# Altium schematic sheet Sheet1.SchDoc
size A2; Address1: Address1; Address2: Address2; Address3: Address3; Address4: Address4; DocumentNumber: АБВГ.123456.001 Э3; SheetNumber: 2; Scale: 1:1; DocumentType: Схема электрическая принципиальная; FirstReferrence: АБВГ.123456.001
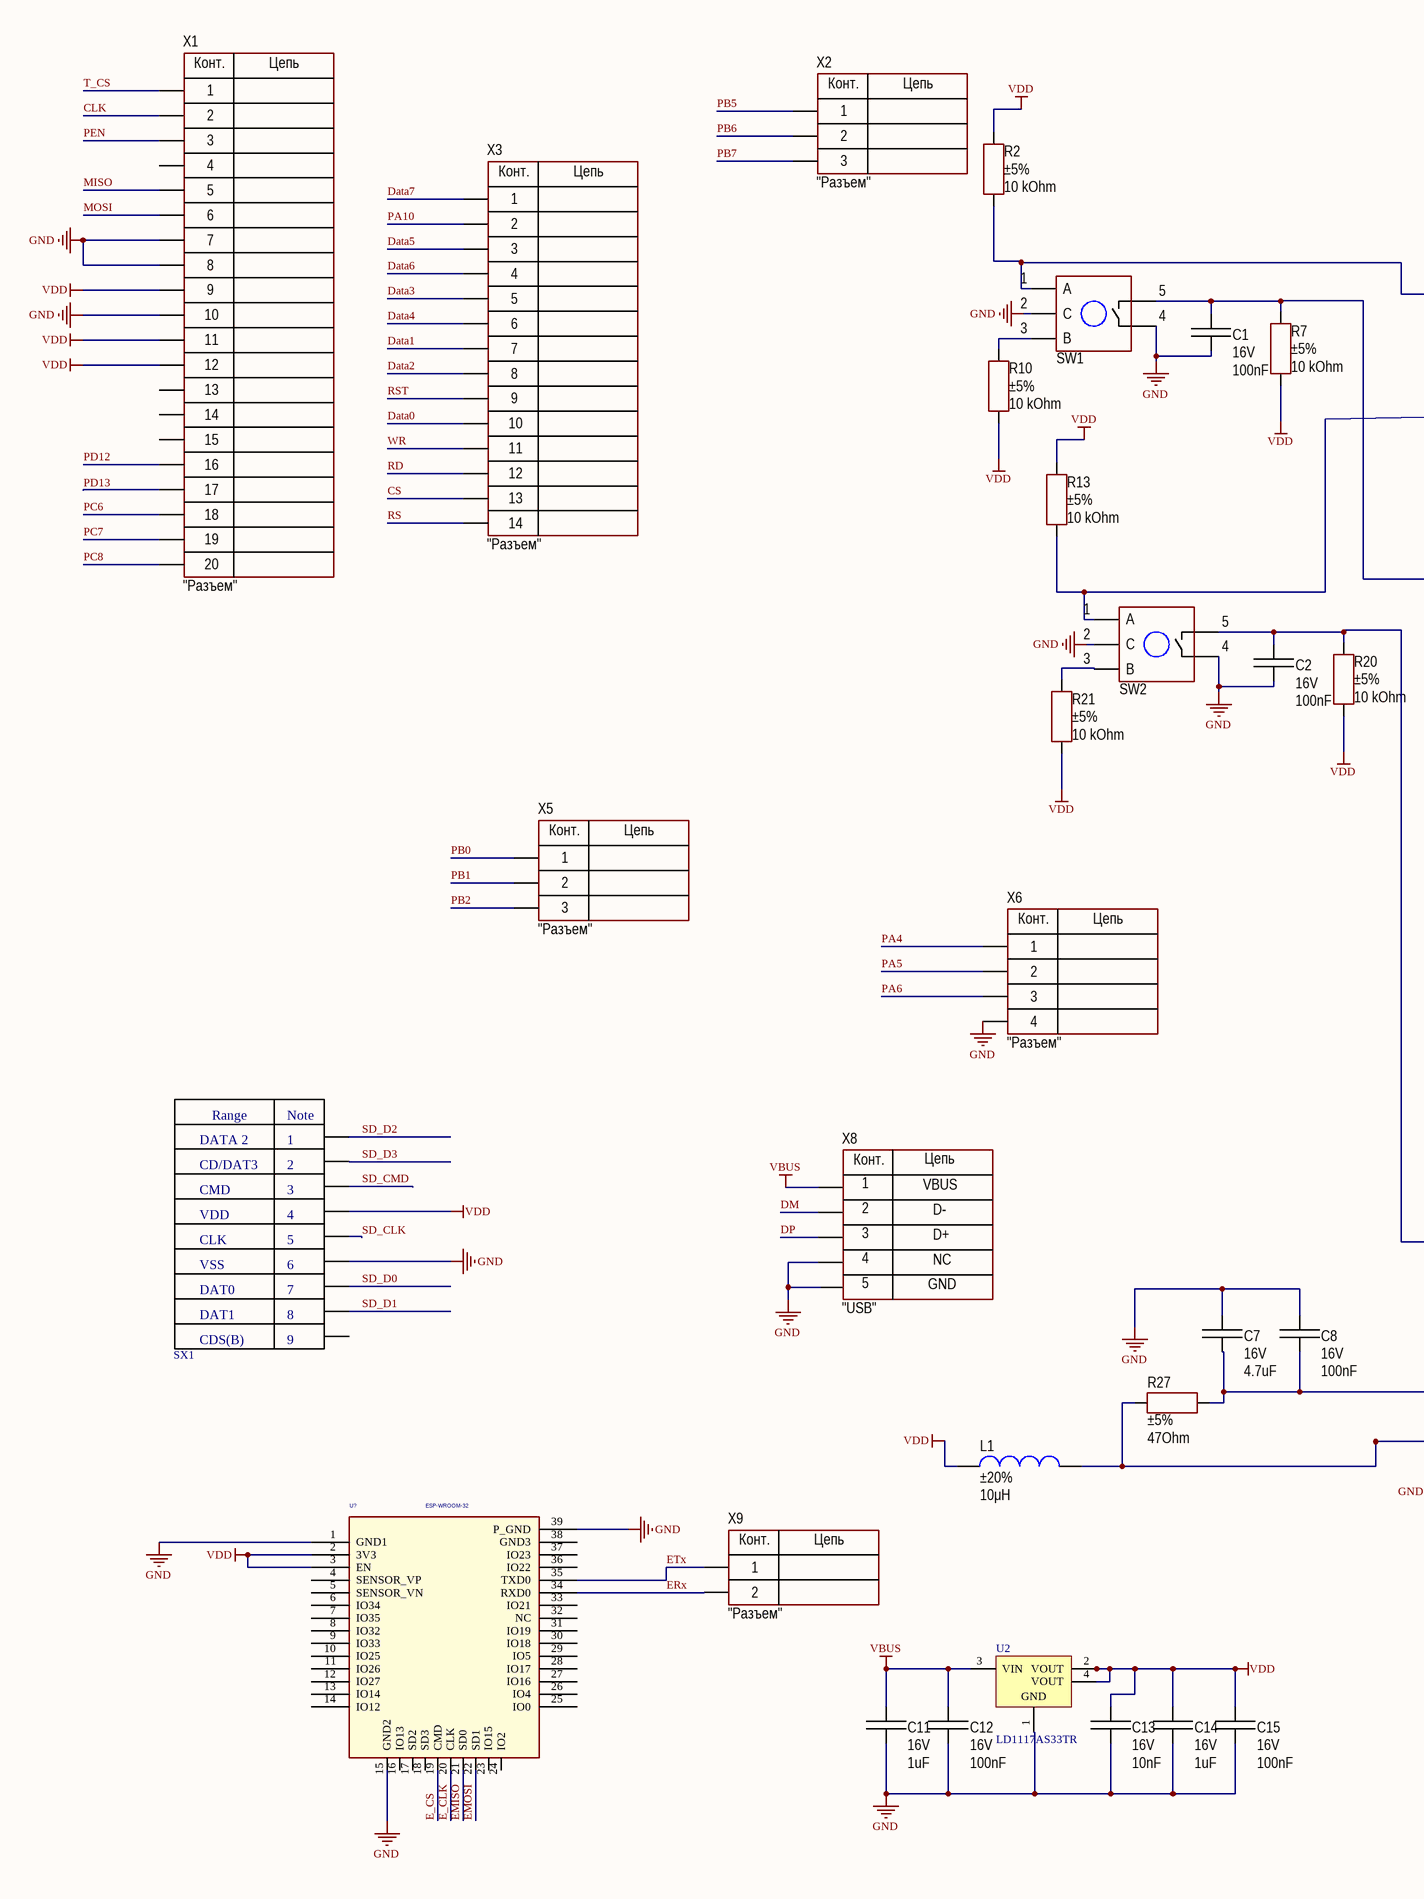
[diagram p0: Sheet1.SchDoc, left]
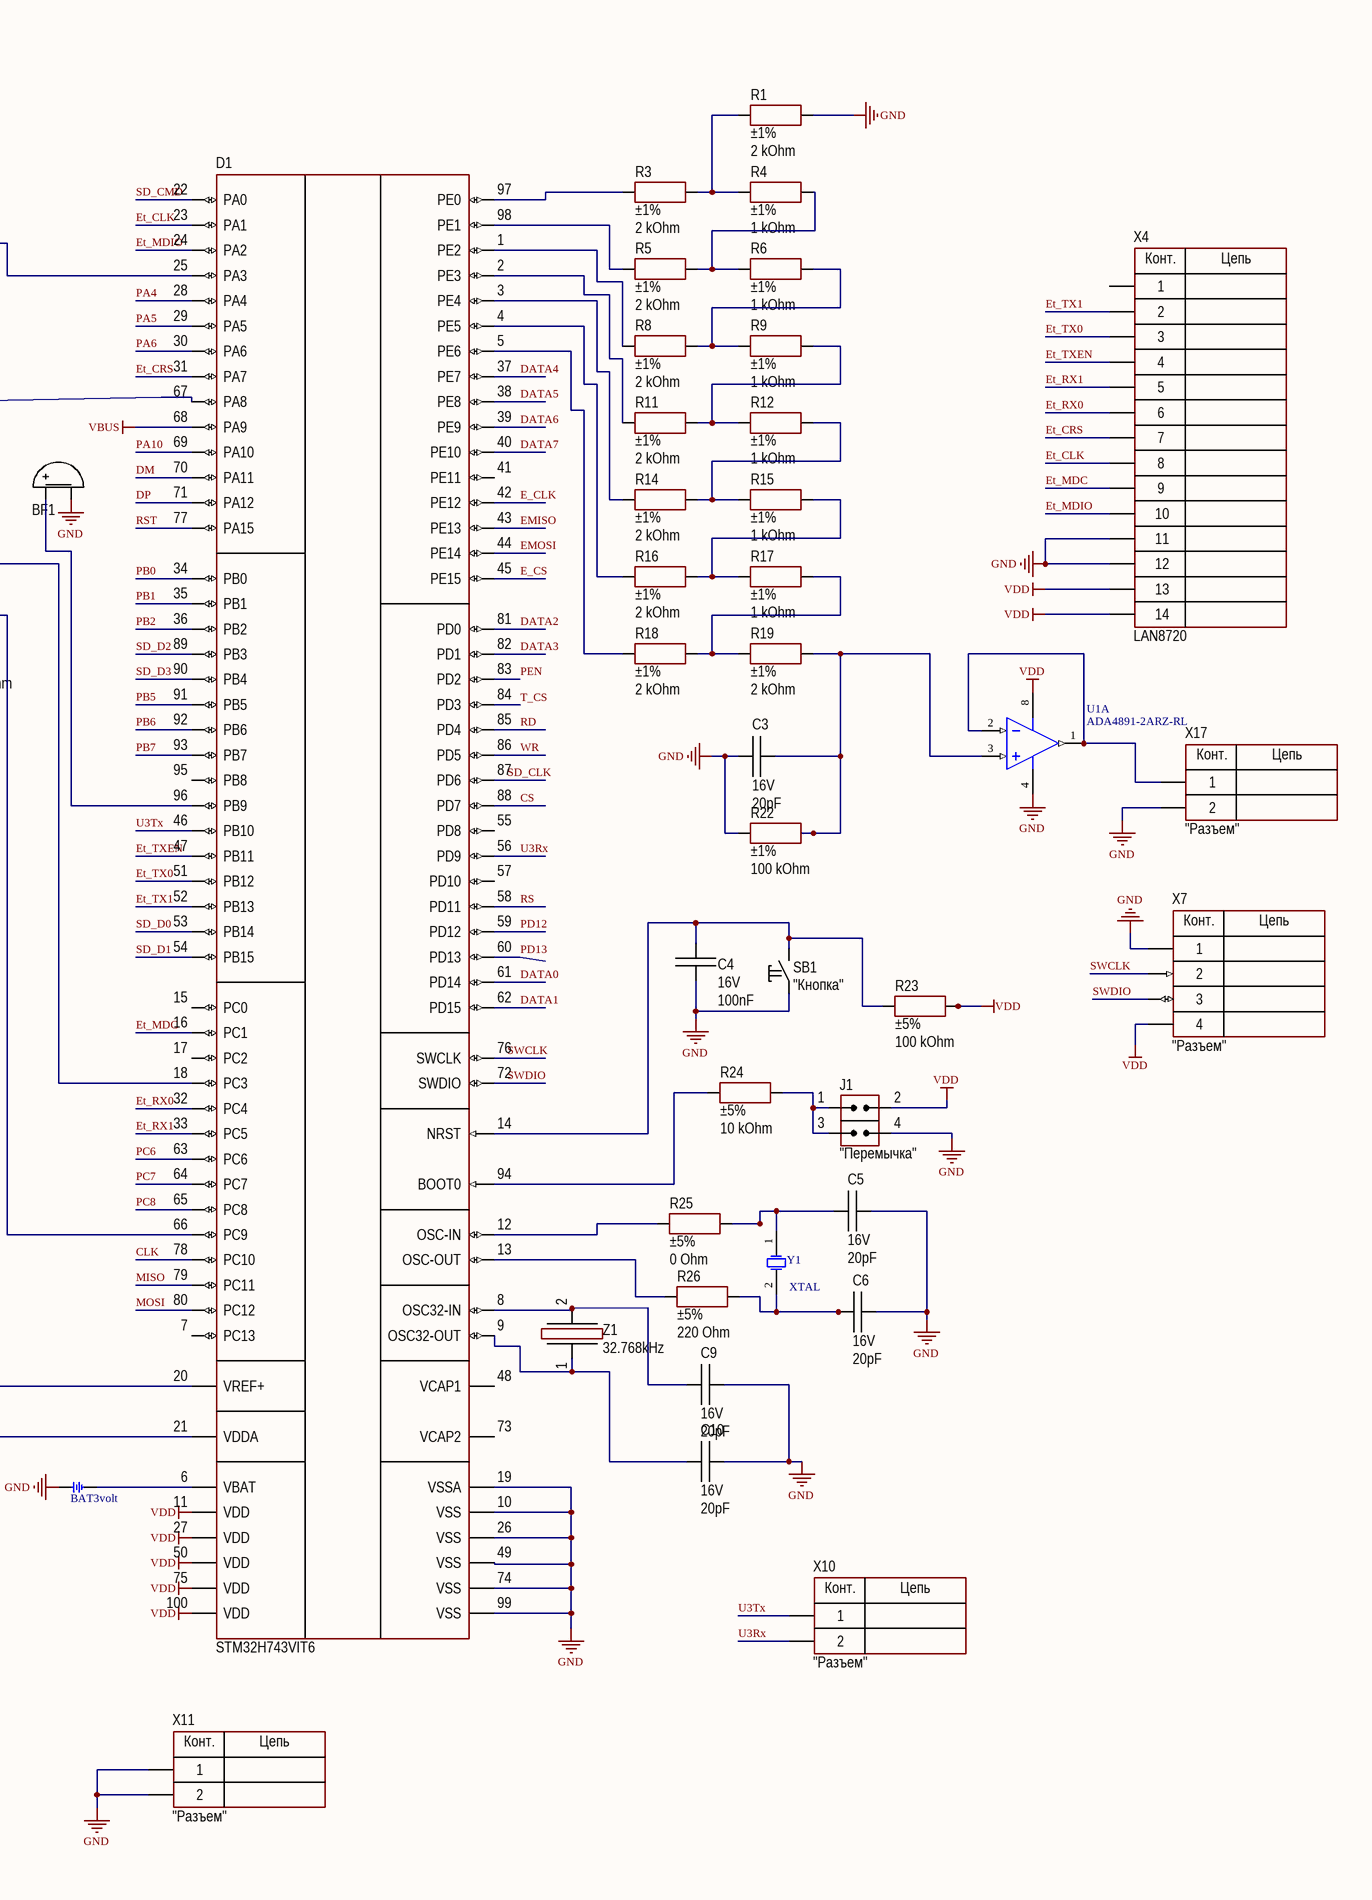
[diagram p1: Sheet1.SchDoc, right]

## Parts
BF1  (no value)  [BUZ: AT-0927-TT-6-R]
BT1  BAT3volt  [BTH2032]
C1  value 100nF  Voltage: 16V  [CAP: 0603]
C2  value 100nF  Voltage: 16V  [CAP: 0603]
C3  value 20pF  Voltage: 16V  [CAP: 0603]
C4  value 100nF  Voltage: 16V  [CAP: 0603]
C5  value 20pF  Voltage: 16V  [CAP: 0603]
C6  value 20pF  Voltage: 16V  [CAP: 0603]
C7  value 4.7uF  Voltage: 16V  [CAP: 0603]
C8  value 100nF  Voltage: 16V  [CAP: 0603]
C9  value 20pF  Voltage: 16V  [CAP: 0603]
C10  value 20pF  Voltage: 16V  [CAP: 0603]
C11  value 1uF  Voltage: 16V  [CAP: 0603]
C12  value 100nF  Voltage: 16V  [CAP: 0603]
C13  value 10nF  Voltage: 16V  [CAP: 0603]
C14  value 1uF  Voltage: 16V  [CAP: 0603]
C15  value 100nF  Voltage: 16V  [CAP: 0603]
D1  (no value)  [100-LQFP]
J1  CommentText: "Перемычка"  [CON: PLD-4]
L1  value 10μH  Tolerance: ±20%  [IND: 0603]
R1  value 2 kOhm  Tolerance: ±1%  [RES: 0603]
R2  value 10 kOhm  Tolerance: ±5%  [RES: 0603]
R3  value 2 kOhm  Tolerance: ±1%  [RES: 0603]
R4  value 1 kOhm  Tolerance: ±1%  [RES: 0603]
R5  value 2 kOhm  Tolerance: ±1%  [RES: 0603]
R6  value 1 kOhm  Tolerance: ±1%  [RES: 0603]
R7  value 10 kOhm  Tolerance: ±5%  [RES: 0603]
R8  value 2 kOhm  Tolerance: ±1%  [RES: 0603]
R9  value 1 kOhm  Tolerance: ±1%  [RES: 0603]
R10  value 10 kOhm  Tolerance: ±5%  [RES: 0603]
R11  value 2 kOhm  Tolerance: ±1%  [RES: 0603]
R12  value 1 kOhm  Tolerance: ±1%  [RES: 0603]
R13  value 10 kOhm  Tolerance: ±5%  [RES: 0603]
R14  value 2 kOhm  Tolerance: ±1%  [RES: 0603]
R15  value 1 kOhm  Tolerance: ±1%  [RES: 0603]
R16  value 2 kOhm  Tolerance: ±1%  [RES: 0603]
R17  value 1 kOhm  Tolerance: ±1%  [RES: 0603]
R18  value 2 kOhm  Tolerance: ±1%  [RES: 0603]
R19  value 2 kOhm  Tolerance: ±1%  [RES: 0603]
R20  value 10 kOhm  Tolerance: ±5%  [RES: 0603]
R21  value 10 kOhm  Tolerance: ±5%  [RES: 0603]
R22  value 100 kOhm  Tolerance: ±1%  [RES: 0603]
R23  value 100 kOhm  Tolerance: ±5%  [RES: 0603]
R24  value 10 kOhm  Tolerance: ±5%  [RES: 0603]
R25  value 0 Ohm  Tolerance: ±5%  [RES: 0603]
R26  value 220 Ohm  Tolerance: ±5%  [RES: 0603]
R27  value 47Ohm  Tolerance: ±5%  [RES: 0603]
SB1  CommentText: "Кнопка"  [BUT: 6x6]
SW1  (no value)  [ENC: PEC-12]
SW2  (no value)  [ENC: PEC-12]
SX1  Microsd  [microsd]  (value not drawn)
U1  ADA4891-2ARZ-RL  [ADI-R-8_N]  (part A of 2)
U2  LD1117AS33TR  [SOT-223_N]
U?  ESP-WROOM-32  [Espressif ESP32-WROOM-32]
X1  CommentText: "Разъем"  [CON: PLD-20]
X2  CommentText: "Разъем"  [CON: PLS-3]
X3  CommentText: "Разъем"  [CON: PLD-14]
X4  CommentText: LAN8720  [CON: PLD-14]
X5  CommentText: "Разъем"  [CON: PLS-3]
X6  CommentText: "Разъем"  [CON: PLS-4]
X7  CommentText: "Разъем"  [CON: PLS-4]
X8  CommentText: "USB"  [CON: 0675031020]
X9  CommentText: "Разъем"  [CON: PLS-2]
X10  CommentText: "Разъем"  [CON: PLS-2]
X11  CommentText: "Разъем"  [CON: PLS-2]
X17  CommentText: "Разъем"  [CON: PLS-2]
Y1  XTAL  [R38]
Z1  Frequency: 32.768kHz  [OSC: 3215]

## Nets
GND: BF1.2(-) BT1.1 C1.2 C2.2 C3.1 C4.2 C5.2 C6.2 C7.2 C8.1 C9.2 C10.2 C11.1 C12.1 C13.1 C14.1 C15.1 D1.10(VSS) D1.19(VSSA) D1.26(VSS) D1.49(VSS) D1.74(VSS) D1.99(VSS) J1.4(IN) R1.1 R22.2 SB1.1 SW1.2(C) SW1.4 SW2.2(C) SW2.4 SX1.6 U1.4(-VS) U2.1(GND) U?.1(GND1) U?.15(GND2) U?.39(P_GND) X1.7 X1.8 X1.10 X4.11 X4.12 X6.4 X7.1 X8.4 X8.5 X11.1 X11.2 X17.2
VBUS: C11.2 C12.2 D1.68(PA9) U2.3(VIN) X8.1
VDD: C13.2 C14.2 C15.2 D1.11(VDD) D1.27(VDD) D1.50(VDD) D1.75(VDD) D1.100(VDD) J1.2(IN) L1.2 R2.2 R7.2 R10.2 R13.2 R20.2 R21.2 R23.1 SX1.4 U1.8(+VS) U2.2(VOUT) U2.4(VOUT) U?.2(3V3) U?.3(EN) X1.9 X1.11 X1.12 X4.13 X4.14 X7.4
CLK: D1.78(PC10) X1.2
CS: D1.88(PD7) X3.13
DATA0: D1.61(PD14) X3.10
DATA1: D1.62(PD15) X3.7
DATA2: D1.81(PD0) X3.8
DATA3: D1.82(PD1) X3.5
DATA4: D1.37(PE7) X3.6
DATA5: D1.38(PE8) X3.3
DATA6: D1.39(PE9) X3.4
DATA7: D1.40(PE10) X3.1
DM: D1.70(PA11) X8.2
DP: D1.71(PA12) X8.3
E_CLK: D1.42(PE12) U?.20(CLK)
E_CS: D1.45(PE15) U?.19(CMD)
EMISO: D1.43(PE13) U?.21(SD0)
EMOSI: D1.44(PE14) U?.22(SD1)
ERx: U?.34(RXD0) X9.2
Et_CLK: D1.23(PA1) X4.8
Et_CRS: D1.31(PA7) X4.7
Et_MDC: D1.16(PC1) X4.9
Et_MDIO: D1.24(PA2) X4.10
Et_RX0: D1.32(PC4) X4.6
Et_RX1: D1.33(PC5) X4.5
Et_TX0: D1.51(PB12) X4.3
Et_TX1: D1.52(PB13) X4.2
Et_TXEN: D1.47(PB11) X4.4
ETx: U?.35(TXD0) X9.1
MISO: D1.79(PC11) X1.5
MOSI: D1.80(PC12) X1.6
PA4: D1.28(PA4) X6.1
PA5: D1.29(PA5) X6.2
PA6: D1.30(PA6) X6.3
PA10: D1.69(PA10) X3.2
PB0: D1.34(PB0) X5.1
PB1: D1.35(PB1) X5.2
PB2: D1.36(PB2) X5.3
PB5: D1.91(PB5) X2.1
PB6: D1.92(PB6) X2.2
PB7: D1.93(PB7) X2.3
PC6: D1.63(PC6) X1.18
PC7: D1.64(PC7) X1.19
PC8: D1.65(PC8) X1.20
PD12: D1.59(PD12) X1.16
PD13: D1.60(PD13) X1.17
PEN: D1.83(PD2) X1.3
RD: D1.85(PD4) X3.12
RS: D1.58(PD11) X3.14
RST: D1.77(PA15) X3.9
SD_CLK: D1.87(PD6) SX1.5
SD_CMD: D1.22(PA0) SX1.3
SD_D0: D1.53(PB14) SX1.7
SD_D1: D1.54(PB15) SX1.8
SD_D2: D1.89(PB3) SX1.1
SD_D3: D1.90(PB4) SX1.2
SWCLK: D1.76(SWCLK) X7.2
SWDIO: D1.72(SWDIO) X7.3
T_CS: D1.84(PD3) X1.1
U3Rx: D1.56(PD9) X10.2
U3Tx: D1.46(PB10) X10.1
WR: D1.86(PD5) X3.11
NetBF1_1: BF1.1(+) D1.96(PB9)
NetBT1_2: BT1.2 D1.6(VBAT)
NetC1_1: C1.1 D1.18(PC3) R7.1 SW1.5
NetC2_1: C2.1 D1.66(PC9) R20.1 SW2.5
NetC3_2: C3.2 R19.1 R22.1 U1.3(+IN_1)
NetC4_1: C4.1 D1.14(NRST) R23.2 SB1.2
NetC5_1: C5.1 R25.1 Y1.1(OSC1)
NetC6_1: C6.1 R26.1 Y1.2(OSC2)
NetC7_1: C7.1 C8.2 D1.20(VREF+) R27.1
NetC9_1: C9.1 D1.8(OSC32-IN) Z1.2
NetC10_1: C10.1 D1.9(OSC32-OUT) Z1.1
NetD1_1: D1.1(PE2) R8.2
NetD1_2: D1.2(PE3) R11.2
NetD1_3: D1.3(PE4) R14.2
NetD1_4: D1.4(PE5) R16.2
NetD1_5: D1.5(PE6) R18.2
NetD1_12: D1.12(OSC-IN) R25.2
NetD1_13: D1.13(OSC-OUT) R26.2
NetD1_21: D1.21(VDDA) L1.1 R27.2
NetD1_25: D1.25(PA3) R2.1 SW1.1(A)
NetD1_67: D1.67(PA8) R13.1 SW2.1(A)
NetD1_94: D1.94(BOOT0) R24.2
NetD1_97: D1.97(PE0) R3.2
NetD1_98: D1.98(PE1) R5.2
NetJ1_1: J1.1(IN) J1.3(IN) R24.1
NetR1_2: R1.2 R3.1 R4.2
NetR4_1: R4.1 R5.1 R6.2
NetR6_1: R6.1 R8.1 R9.2
NetR9_1: R9.1 R11.1 R12.2
NetR10_1: R10.1 SW1.3(B)
NetR12_1: R12.1 R14.1 R15.2
NetR15_1: R15.1 R16.1 R17.2
NetR17_1: R17.1 R18.1 R19.2
NetR21_1: R21.1 SW2.3(B)
NetU1_1: U1.1(OUT_1) U1.2(-IN_1) X17.1

Not connected (* = marked no-connect by the designer): D1 7(PC13) 15(PC0) 17(PC2) 41(PE11) 48(VCAP1) 55(PD8) 57(PD10) 73(VCAP2) 95(PB8); SX1 9; U? 4(SENSOR_VP) 5(SENSOR_VN) 6(IO34) 7(IO35) 8(IO32) 9(IO33) 10(IO25) 11(IO26) 12(IO27) 13(IO14) 14(IO12) 16(IO13) 17(SD2) 18(SD3) 23(IO15) 24(IO2) 25(IO0) 26(IO4) 27(IO16) 28(IO17) 29(IO5) 30(IO18) 31(IO19) 32(NC) 33(IO21) 36(IO22) 37(IO23) 38(GND3); X1 4 13 14 15; X4 1

## Notes on the sheet
- Title
- Size:
- Date:
- File:
- A2
- Number:
- Time:
- Revision:
- Sheet
- of
- (in symbol Connector_USB_mini_B) Конт.; Цепь; VBUS; D-; D+; NC; GND
- (in symbol Microsd) Range; Note; DATA 2; CD/DAT3; CMD; VDD; CLK; VSS; DAT0; DAT1; CDS(B)
- (in symbol PLD-14) Конт.; Цепь
- (in symbol PLD-20) Конт.; Цепь
- (in symbol PLS-2) Конт.; Цепь
- (in symbol PLS-3) Конт.; Цепь
- (in symbol PLS-4) Конт.; Цепь

## Library data of the parts
BF1 = Buzzer: Manufacturer: PUI Audio; ValueManufacturerPartNumber: DIP switch, 2.73 kHz, 3VDC, 80mA, -20...+70°C; PartNumber: AT-0927-TT-6-R; TypeBuzzer: DIP switch; VoltageMax: 3VDC; Frequency: 2.73 kHz; CurrentMax: 80mA; HelpURL: https://www.digikey.com/products/en?keywords=AT-0927-TT-6-R; Temperature: -20...+70°C
BT1 = BATH_CR2032: BATTERY HOLDER, CR2032; VALUE: BAT3volt; MANF_P#: -; .: http://www.chila.ir
C1 C2 C4 C8 C12 C15 = Ceramic_0603: Manufacturer: Yageo; PartNumber: CC0603KRX7R7BB104; ValueManufacturerPartNumber: Ceramic capacitor, 100nF, X7R, ±10%, 16V, 0603, -55...+125°C; TypeCapacitor: Ceramic capacitor; Tolerance: ±10%; TypeDielectric: X7R; Package: 0603; HelpURL: https://www.digikey.com/product-detail/en/yageo/CC0603KRX7R7BB104/311-1088-1-ND/302998; Temperature: -55...+125°C
C3 C5 C6 C9 C10 = Ceramic_0603: Manufacturer: Yageo; PartNumber: CC0603KRX7R7BB104; ValueManufacturerPartNumber: Ceramic capacitor, 20pF, X7R, ±10%, 16V, 0603, -55...+125°C; TypeCapacitor: Ceramic capacitor; Tolerance: ±10%; TypeDielectric: X7R; Package: 0603; HelpURL: https://www.digikey.com/product-detail/en/yageo/CC0603KRX7R7BB104/311-1088-1-ND/302998; Temperature: -55...+125°C
C7 = Ceramic_0603: Manufacturer: Yageo; PartNumber: CC0603KRX7R7BB104; ValueManufacturerPartNumber: Ceramic capacitor, 4.7uF, X7R, ±10%, 16V, 0603, -55...+125°C; TypeCapacitor: Ceramic capacitor; Tolerance: ±10%; TypeDielectric: X7R; Package: 0603; HelpURL: https://www.digikey.com/product-detail/en/yageo/CC0603KRX7R7BB104/311-1088-1-ND/302998; Temperature: -55...+125°C
C11 C14 = Ceramic_0603: Manufacturer: Yageo; PartNumber: CC0603KRX7R7BB104; ValueManufacturerPartNumber: Ceramic capacitor, 1uF, X7R, ±10%, 16V, 0603, -55...+125°C; TypeCapacitor: Ceramic capacitor; Tolerance: ±10%; TypeDielectric: X7R; Package: 0603; HelpURL: https://www.digikey.com/product-detail/en/yageo/CC0603KRX7R7BB104/311-1088-1-ND/302998; Temperature: -55...+125°C
C13 = Ceramic_0603: Manufacturer: Yageo; PartNumber: CC0603KRX7R7BB104; ValueManufacturerPartNumber: Ceramic capacitor, 10nF, X7R, ±10%, 16V, 0603, -55...+125°C; TypeCapacitor: Ceramic capacitor; Tolerance: ±10%; TypeDielectric: X7R; Package: 0603; HelpURL: https://www.digikey.com/product-detail/en/yageo/CC0603KRX7R7BB104/311-1088-1-ND/302998; Temperature: -55...+125°C
D1 = STM32H743VIT6: Cortex-M7; Manufacturer: STMicroelectronics; ValueManufacturerPartNumber: IC microcontroller, 32-Bit, Cortex-M7, 400MHz, 2048KB, 1024KB, 1.71...3.6V, -40...+85°C, 100-LQFP; Supply: 1.71...3.6V; Speed: 400MHz; CoreSize: 32-Bit; MemoryROM: 2048KB; MemoryRAM: 1024KB; HelpURL: https://www.digikey.com/products/en?keywords=STM32H743VIT6; Package: 100-LQFP; ComponentType: IC microcontroller; Temperature: -40...+85°C; CoreProcessor: Cortex-M7; PartNumber: STM32H743VIT6
J1 = Jumper_double
L1 = Inductor_0603: Manufacturer: Murata Electronics; PartNumber: LQM18FN100M00D; ValueManufacturerPartNumber: Fixed inductor, 10μH, ±20%, 0603, 50mA, -55...+125°C; TypeInductor: Fixed inductor; MaxCurrent: 50mA; Package: 0603; HelpURL: https://www.digikey.com/product-detail/en/murata-electronics-north-america/LQM18FN100M00D/490-4025-1-ND/1016285; Temperature: -55...+125°C
R1 R3 R5 R8 R11 R14 R16 R18 R19 = Resistor_0603: Manufacturer: Yageo; PartNumber: RC0603JR-07100RL; ValueManufacturerPartNumber: Resistor film, 2 kOhm, ±1%, 0603, 0.1W, -55...+125°C; TypeResistor: Resistor film; Power: 0.1W; Package: 0603; HelpURL: https://www.digikey.com/product-detail/en/yageo/RC0603JR-07100RL/311-100GRCT-ND/729644; Temperature: -55...+125°C
R2 R7 R10 R13 R20 R21 R24 = Resistor_0603: Manufacturer: Yageo; PartNumber: RC0603JR-07100RL; ValueManufacturerPartNumber: Resistor film, 10 kOhm, ±5%, 0603, 0.1W, -55...+125°C; TypeResistor: Resistor film; Power: 0.1W; Package: 0603; HelpURL: https://www.digikey.com/product-detail/en/yageo/RC0603JR-07100RL/311-100GRCT-ND/729644; Temperature: -55...+125°C
R4 R6 R9 R12 R15 R17 = Resistor_0603: Manufacturer: Yageo; PartNumber: RC0603JR-07100RL; ValueManufacturerPartNumber: Resistor film, 1 kOhm, ±1%, 0603, 0.1W, -55...+125°C; TypeResistor: Resistor film; Power: 0.1W; Package: 0603; HelpURL: https://www.digikey.com/product-detail/en/yageo/RC0603JR-07100RL/311-100GRCT-ND/729644; Temperature: -55...+125°C
R22 = Resistor_0603: Manufacturer: Yageo; PartNumber: RC0603JR-07100RL; ValueManufacturerPartNumber: Resistor film, 100 kOhm, ±1%, 0603, 0.1W, -55...+125°C; TypeResistor: Resistor film; Power: 0.1W; Package: 0603; HelpURL: https://www.digikey.com/product-detail/en/yageo/RC0603JR-07100RL/311-100GRCT-ND/729644; Temperature: -55...+125°C
R23 = Resistor_0603: Manufacturer: Yageo; PartNumber: RC0603JR-07100RL; ValueManufacturerPartNumber: Resistor film, 100 kOhm, ±5%, 0603, 0.1W, -55...+125°C; TypeResistor: Resistor film; Power: 0.1W; Package: 0603; HelpURL: https://www.digikey.com/product-detail/en/yageo/RC0603JR-07100RL/311-100GRCT-ND/729644; Temperature: -55...+125°C
R25 = Resistor_0603: Manufacturer: Yageo; PartNumber: RC0603JR-07100RL; ValueManufacturerPartNumber: Resistor film, 0 Ohm, ±5%, 0603, 0.1W, -55...+125°C; TypeResistor: Resistor film; Power: 0.1W; Package: 0603; HelpURL: https://www.digikey.com/product-detail/en/yageo/RC0603JR-07100RL/311-100GRCT-ND/729644; Temperature: -55...+125°C
R26 = Resistor_0603: Manufacturer: Yageo; PartNumber: RC0603JR-07100RL; ValueManufacturerPartNumber: Resistor film, 220 Ohm, ±5%, 0603, 0.1W, -55...+125°C; TypeResistor: Resistor film; Power: 0.1W; Package: 0603; HelpURL: https://www.digikey.com/product-detail/en/yageo/RC0603JR-07100RL/311-100GRCT-ND/729644; Temperature: -55...+125°C
R27 = Resistor_0603: Manufacturer: Yageo; PartNumber: RC0603JR-07100RL; ValueManufacturerPartNumber: Resistor film, 47Ohm, ±5%, 0603, 0.1W, -55...+125°C; TypeResistor: Resistor film; Power: 0.1W; Package: 0603; HelpURL: https://www.digikey.com/product-detail/en/yageo/RC0603JR-07100RL/311-100GRCT-ND/729644; Temperature: -55...+125°C
SB1 = Button_tactile: Manufacturer: TE Connectivity; ValueManufacturerPartNumber: Tactile button, 6x6mm; PartNumber: FSM2JSMAATR; TypeButton: Tactile button; HelpURL: https://www.digikey.com/product-detail/en/te-connectivity-alcoswitch-switches/FSM2JSMAATR/450-1792-1-ND/3503931; Package: 6x6mm
SW1 SW2 = Encoder_PEC12: Manufacturer: Bourns; ValueManufacturerPartNumber: Quadrature encoder, PEC12R; PartNumber: PEC12R-4115F-S0012; TypeEncoder: Quadrature encoder; SeriesEncoder: PEC12R; HelpURL: https://www.digikey.com/product-detail/en/bourns-inc/PEC12R-4115F-S0012/PEC12R-4115F-S0012-ND/6153386
U1 = ADA4891-2ARZ-RL: Double Channel Single-Supply Operation Operational Amplifier, 220 MHz BW, 170 V/us SR, Industrial, 8-pin SOIC (R-8), Reel; Manufacturer: Analog Devices; Amplifiers Per Package: 2; Input Bias Current: 2pA; Input Offset Voltage: 2.5mV; Iq/Amp: 4.4mA; Small Signal Bandwidth: 220MHz; V Span Max: 5.5V; V Span Min: 2.7V; DatasheetVersion: Rev. D; PackageVersion: 060506-A; PackageReference: R-8; PackageDescription: 8-Pin Standard Small Outline Package, Body 3.9 x 4.9 mm, Pitch 1.27 mm; Supplier 1: Digi-Key; Supplier Part Number 1: ADA4891-2ARZ-RL-ND; Packing: Reel; Generic Part Number: ADA4891-2; Slew Rate: 170V/us; Mounting Technology: Surface Mount; Code_JEDEC: MS-012-AA; PartNumber: ADA4891-2ARZ-RL; ComponentLink1Description: Manufacturer URL; ComponentLink1URL: http://www.analog.com/en/index.html; ComponentLink2Description: Datasheet; ComponentLink2URL: http://www.analog.com/static/imported-files/data_sheets/ADA4891-1_4891-2_4891-3_4891-4.PDF; ComponentLink3Description: Package Specification; ComponentLink3URL: http://www.analog.com/static/imported-files/packages/PKG_PDF/SOIC_Narrow%20(R)/R_8.pdf
U2 = LD1117AS33TR: 1A, Low Drop Positive Voltage Regulator, 3.3V, 4-Pin SOT-223, Tape and Reel; DatasheetVersion: Dec-2011; PackageVersion: 2010; PackageReference: SOT-223; PackageDescription: 4-Pin SOT-223 Package, 6.5 x 3.5 mm Body, 2.3 mm Pitch, 7 mm Lead Span; PartNumber: LD1117AS33TR; ComponentLink1Description: Manufacturer URL; ComponentLink1URL: http://www.st.com; ComponentLink2Description: Datasheet; ComponentLink2URL: http://www.st.com/internet/com/TECHNICAL_RESOURCES/TECHNICAL_LITERATURE/DATASHEET/CD00002116.pdf
U? = ESP32_MODULE_0
X1 = PLD-20: Manufacturer: Connfly; ValueManufacturerPartNumber: Connector, 20pin, 2.54mm, 500VAC, 3A; TypeConnector: Connector; VoltageMax: 500VAC; Pitch: 2.54mm; CurrentMax: 3A; Multichannel: 20pin; HelpURL: https://www.chipdip.ru/product/pld-20; PartNumber: PLD-20
X2 X5 = PLS-3: Manufacturer: Connfly; ValueManufacturerPartNumber: Connector, 3pin, 2.54mm, 500VAC, 3A; TypeConnector: Connector; VoltageMax: 500VAC; Pitch: 2.54mm; CurrentMax: 3A; Multichannel: 3pin; HelpURL: https://www.chipdip.ru/product/pls-3; PartNumber: PLS-3
X3 X4 = PLD-14: Manufacturer: Connfly; ValueManufacturerPartNumber: Connector, 14pin, 2.54mm, 500VAC, 3A; TypeConnector: Connector; VoltageMax: 500VAC; Pitch: 2.54mm; CurrentMax: 3A; Multichannel: 14pin; HelpURL: https://www.chipdip.ru/product/ds1021-2-7-sf11-pld-14; PartNumber: PLD-14
X6 X7 = PLS-4: Manufacturer: Connfly; ValueManufacturerPartNumber: Connector, 4pin, 2.54mm, 500VAC, 3A; TypeConnector: Connector; VoltageMax: 500VAC; Pitch: 2.54mm; CurrentMax: 3A; Multichannel: 4pin; HelpURL: https://www.chipdip.ru/product/pls-4; PartNumber: PLS-4
X8 = Connector_USB_mini_B: Manufacturer: Molex; ValueManufacturerPartNumber: USB mini B; PartNumber: 0675031020; HelpURL: https://www.digikey.com/product-detail/en/molex/0675031020/WM5461CT-ND/1624427; TypeConnector: USB mini B
X9-X11 X17 = PLS-2: Manufacturer: Connfly; ValueManufacturerPartNumber: Connector, 2pin, 2.54mm, 500VAC, 3A; TypeConnector: Connector; VoltageMax: 500VAC; Pitch: 2.54mm; CurrentMax: 3A; Multichannel: 2pin; HelpURL: https://www.chipdip.ru/product/pls-2; PartNumber: PLS-2
Y1 = XTAL: Crystal Oscillator; Published: 8-Jun-2000; LatestRevisionDate: 17-Jul-2002; LatestRevisionNote: Re-released for DXP Platform.; PackageReference: R38; Publisher: Altium Limited; PackageDescription: Crystal, Thru-Hole; 2 Leads; Body 3.1 x 8.2 mm (Dia.xH)
Z1 = Crystal_3215: Manufacturer: Epson; PartNumber: FC-135 32.7680KA-A5; ValueManufacturerPartNumber: Crystal, 32.768kHz, 12.5pF, ±20ppm, case 3215, -40...+85°C; LoadCapacitance: 12.5pF; Tolerance: ±20ppm; Package: case 3215; HelpURL: https://www.digikey.com/product-detail/en/epson/FC-135-32.7680KA-A5/SER4103CT-ND/6188447; Temperature: -40...+85°C; TypeOscilator: Crystal